# EAGLE design StraightThumbs (EAGLE 9.0.1)
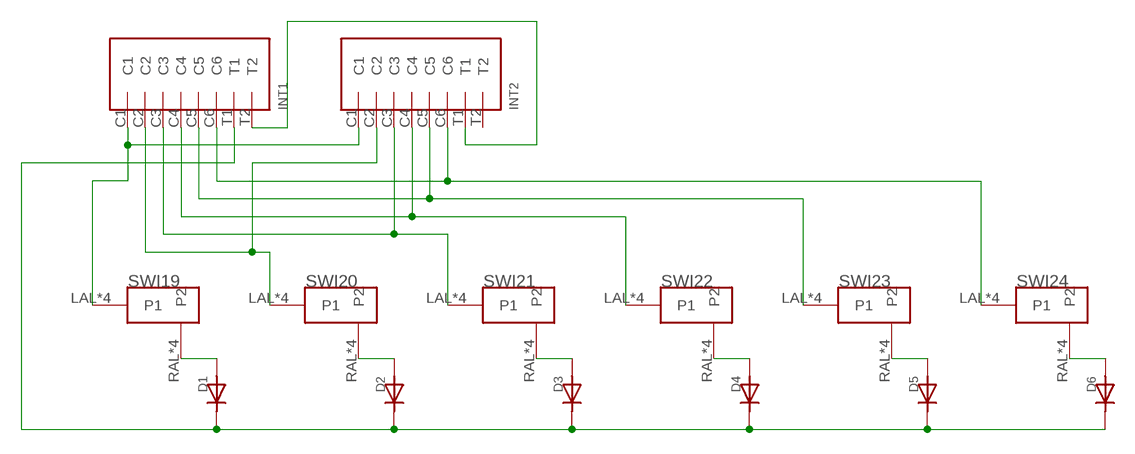
[diagram p0: schematic, sheet 1]

## Parts
D1  DIODE  [DIODE_COMBO]
D2  DIODE  [DIODE_COMBO]
D3  DIODE  [DIODE_COMBO]
D4  DIODE  [DIODE_COMBO]
D5  DIODE  [DIODE_COMBO]
D6  DIODE  [DIODE_COMBO]
INT1  INTRCNNT  [INTRCNNT]
INT2  INTRCNNT  [INTRCNNT]
SWI19  MX/ALPSDOUBLESIDED  [DOUBLED_MX/ALPS]
SWI20  MX/ALPSDOUBLESIDED  [DOUBLED_MX/ALPS]
SWI21  MX/ALPSDOUBLESIDED  [DOUBLED_MX/ALPS]
SWI22  MX/ALPSDOUBLESIDED  [DOUBLED_MX/ALPS]
SWI23  MX/ALPSDOUBLESIDED  [DOUBLED_MX/ALPS]
SWI24  MX/ALPSDOUBLESIDED  [DOUBLED_MX/ALPS]

## Nets
N$1: D1.ANOSB(AN) D1.ANOST(AN) D1.ANOT(AN) SWI19.RAL(P2) SWI19.RAR(P2) SWI19.RCL(P2) SWI19.RCR(P2)
N$2: D2.ANOSB(AN) D2.ANOST(AN) D2.ANOT(AN) SWI20.RAL(P2) SWI20.RAR(P2) SWI20.RCL(P2) SWI20.RCR(P2)
N$3: D3.ANOSB(AN) D3.ANOST(AN) D3.ANOT(AN) SWI21.RAL(P2) SWI21.RAR(P2) SWI21.RCL(P2) SWI21.RCR(P2)
N$4: D4.ANOSB(AN) D4.ANOST(AN) D4.ANOT(AN) SWI22.RAL(P2) SWI22.RAR(P2) SWI22.RCL(P2) SWI22.RCR(P2)
N$5: D5.ANOSB(AN) D5.ANOST(AN) D5.ANOT(AN) SWI23.RAL(P2) SWI23.RAR(P2) SWI23.RCL(P2) SWI23.RCR(P2)
N$6: D6.ANOSB(AN) D6.ANOST(AN) D6.ANOT(AN) SWI24.RAL(P2) SWI24.RAR(P2) SWI24.RCL(P2) SWI24.RCR(P2)
N$7: INT1.C1 INT2.C1 SWI19.LAL(P1) SWI19.LAR(P1) SWI19.LCL(P1) SWI19.LCR(P1)
N$8: INT1.C2 INT2.C2 SWI20.LAL(P1) SWI20.LAR(P1) SWI20.LCL(P1) SWI20.LCR(P1)
N$9: INT1.C3 INT2.C3 SWI21.LAL(P1) SWI21.LAR(P1) SWI21.LCL(P1) SWI21.LCR(P1)
N$10: INT1.C4 INT2.C4 SWI22.LAL(P1) SWI22.LAR(P1) SWI22.LCL(P1) SWI22.LCR(P1)
N$11: INT1.C5 INT2.C5 SWI23.LAL(P1) SWI23.LAR(P1) SWI23.LCL(P1) SWI23.LCR(P1)
N$12: INT1.C6 INT2.C6 SWI24.LAL(P1) SWI24.LAR(P1) SWI24.LCL(P1) SWI24.LCR(P1)
N$13: D1.CATSB(CAT) D1.CATST(CAT) D1.CATT(CAT) D2.CATSB(CAT) D2.CATST(CAT) D2.CATT(CAT) D3.CATSB(CAT) D3.CATST(CAT) D3.CATT(CAT) D4.CATSB(CAT) D4.CATST(CAT) D4.CATT(CAT) D5.CATSB(CAT) D5.CATST(CAT) D5.CATT(CAT) D6.CATSB(CAT) D6.CATST(CAT) D6.CATT(CAT) INT1.T1
N$14: INT1.T2 INT2.T1
Unconnected: INT2.T2

## Library data of the parts
D1-D6 = Keys:DIODE
INT1 INT2 = Keys:INTRCNNT
SWI19-SWI24 = Keys:MX/ALPS

## Board
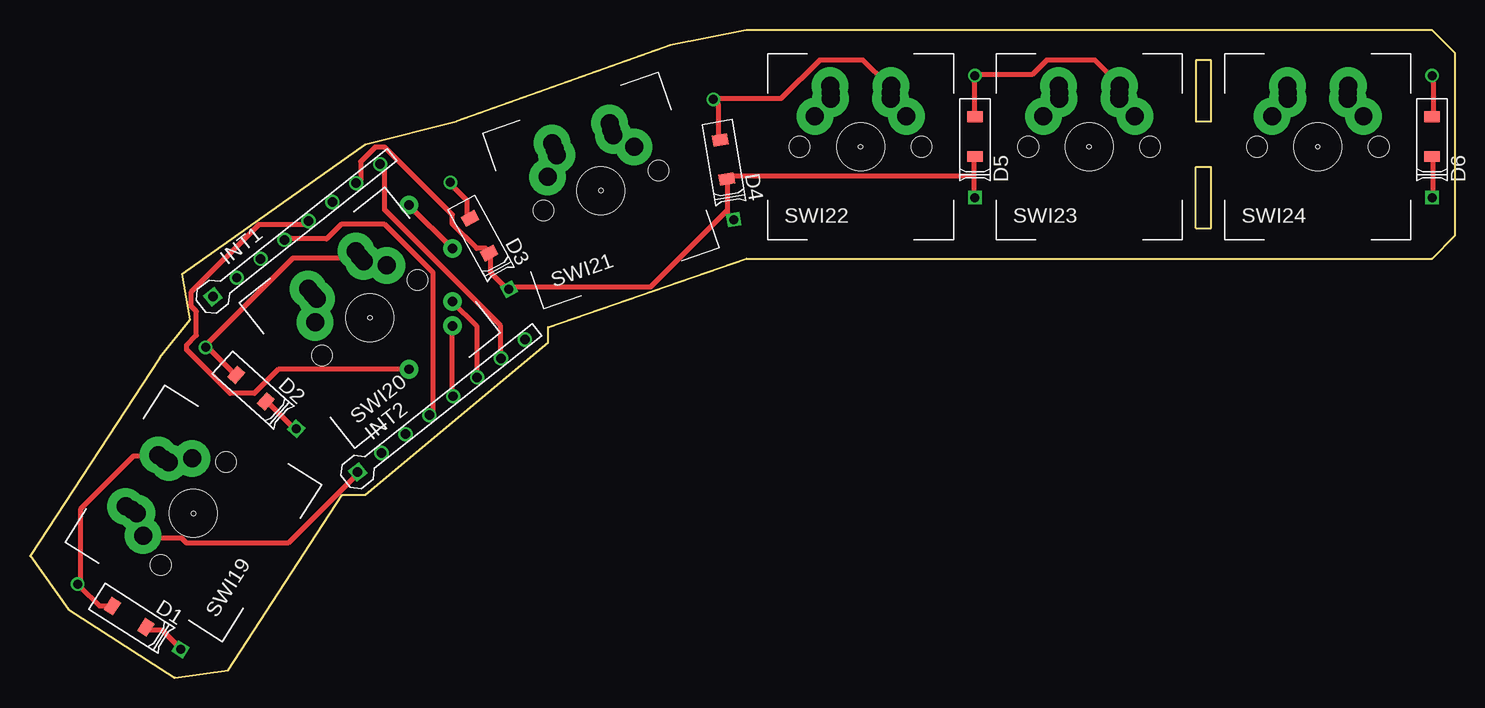
[diagram p1: board, top side]
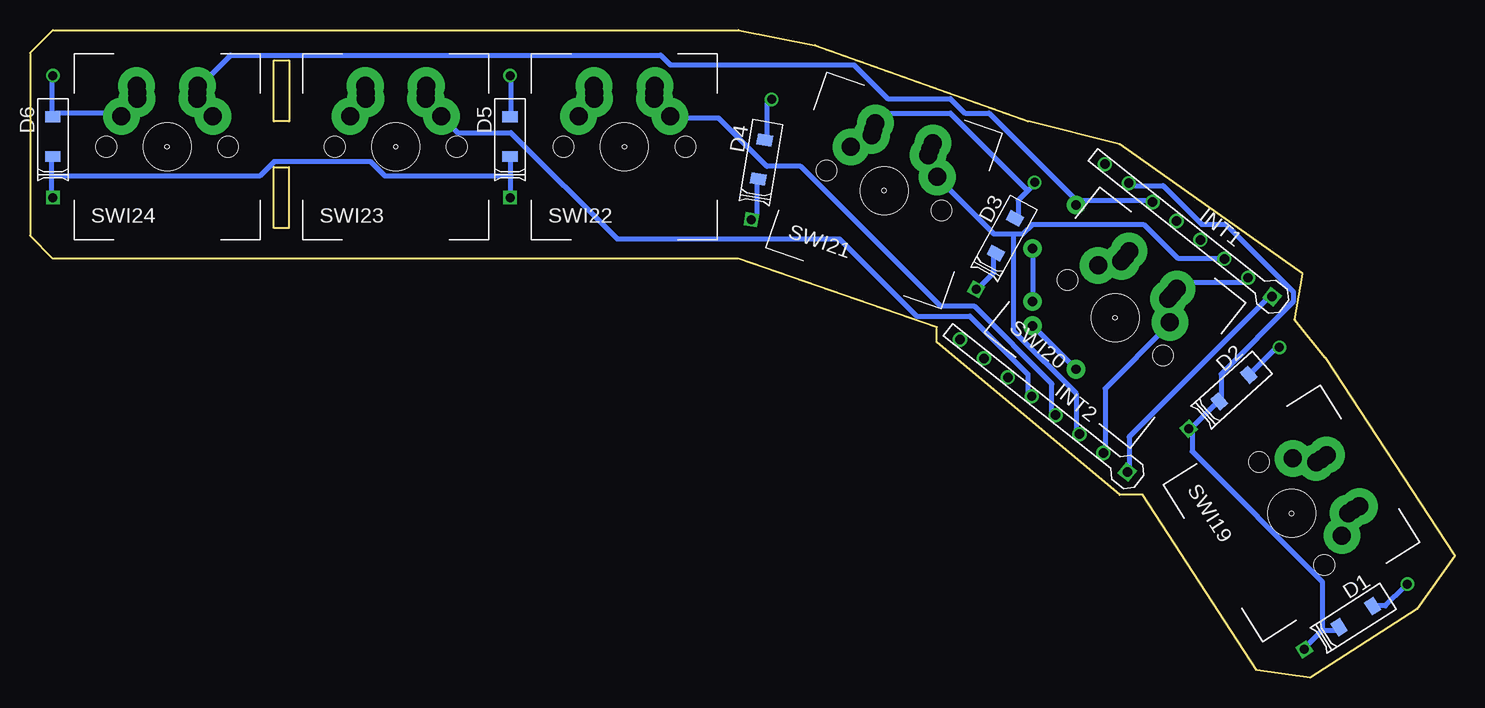
[diagram p2: board, bottom side, seen from below]

Size 118.74 x 53.97 mm. Coordinates in mm from the lower left corner, seen from the top.
Outline: 116.84,53.97 59.69,53.97 53.34,52.7 35.56,46.35 27.94,44.45 12.7,33.65 13.34,29.84 10.79,26.67 0,10.16 3.17,5.71 12.06,0 16.51,0.64 26.04,15.24 27.94,15.24 43.18,27.94 43.18,29.21 59.69,34.92 116.84,34.92 118.74,36.83 118.74,52.07 116.84,53.97
Outline: 97.16,51.43 97.16,46.35 98.42,46.35 98.42,51.43 97.16,51.43
Outline: 97.16,37.46 98.42,37.46 98.42,42.54 97.16,42.54 97.16,37.46
Copper layers (1*16): Top 0.035mm / dielectric 1.5mm / Bottom 0.035mm
Design rules "OthermillDRC_1_64_v2": minimum track width 16mil, minimum drill 31mil, track to track 0.39878125mm, track to pad 0.39878125mm, pad to pad 0.39878125mm, via to via 0.39878125mm, smd to smd 0mil, copper to edge 0mil, drill to drill 1mil, minimum pad ring 0mil, minimum via ring 15mil, stop-mask expansion 1mil, vias tented up to drill 30mil, thermal gap 10mil

### Footprints (pad centres in the part's own frame; a part is rotated, then mirrored left to right if it is on the bottom)
DIODE_COMBO = smd 0.914 x 1.27 bottom: ANOSB 1.651,0; CATSB -1.651,0 | smd 0.914 x 1.27: ANOST 1.651,0; CATST -1.651,0 | drill 0.75: ANOT 5.08,0 | drill 0.75 square: CATT -5.08,0
INTRCNNT = drill 0.787 pad 1.143 square: C1 0,0 | drill 0.787 pad 1.143: C2 2.54,0; C3 5.08,0; C4 7.62,0; C5 10.16,0; C6 12.7,0; T1 15.24,0; T2 17.78,0
DOUBLED_MX/ALPS = drill 1.5 pad 3.048: LAL -2.5,4; RAL 2.5,4 | drill 1.5: LAR -2.5,4.5; RAR 2.5,4.5 | drill 1.499 pad 3.048: LCL -3.81,2.54; LCR -2.54,5.08; RCL 3.81,2.54; RCR 2.54,5.08 | hole 0.35: 0,0 | hole 3.988: 0,0 | hole 1.702: -5.08,0; 5.08,0

### Placement (x,y rotation side)
D1  8.26,5.08 147.6 top
D2  18.41,24.13 138 top
D3  37.47,36.83 118.7 top
D4  57.79,43.18 99.6 top
D5  78.74,45.08 90 top
D6  116.84,45.08 90 top
INT1  15.24,31.75 38.4 top
INT2  27.3,17.14 38.4 top
SWI19  13.61,13.69 57.6 top
SWI20  28.32,30 38.4 top
SWI21  47.57,40.59 19.2 top
SWI22  69.21,44.25 0 top
SWI23  88.27,44.25 0 top
SWI24  107.31,44.25 0 top

### Tracks (layer width: path | path; a pad name or v marks a point on that pad's centre or on a via)
N$1
  Top 0.406: D1.ANOST 6.61,5.98 5.81,5.98 4.2,7.59 D1.ANOT 4.2,7.99 4.2,14.03 8.62,18.46 10.64,18.46 SWI19.RCR
  Bottom 0.406: D1.ANOST 6.61,5.98 5.81,5.98 4.2,7.59 D1.ANOT
N$2
  Top 0.406: 14.66,27.72 17.08,25.3 D2.ANOST | 14.66,27.72 21.91,34.96 27.14,34.96 SWI20.RCR | 14.66,27.72 D2.ANOT
  Bottom 0.406: D2.ANOST 17.08,25.3 14.66,27.72 D2.ANOT
N$3
  Top 0.406: D3.ANOST 36.4,38.59 36.4,39.79 35.2,41 D3.ANOT
  Bottom 0.406: 35.6,40.6 35.2,41 D3.ANOT | 35.6,40.6 36.4,39.79 36.4,38.59 D3.ANOST | 35.6,40.6 42.04,47.04 47.27,47.04 48.08,46.24 SWI21.RCR
N$4
  Top 0.406: D4.ANOST 57.34,45.03 57.34,47.85 D4.ANOT 57.34,48.25 62.57,48.25 65.79,51.47 69.42,51.47 71.43,49.46 SWI22.RCR
  Bottom 0.406: D4.ANOST 57.34,45.03 57.34,47.85 D4.ANOT
N$5
  Top 0.406: D5.ANOST 78.67,47.04 78.67,49.86 D5.ANOT 79.08,50.26 83.51,50.26 84.71,51.47 88.74,51.47 90.75,49.46 SWI23.RAL
  Bottom 0.406: D5.ANOST 78.67,47.04 78.67,49.86 D5.ANOT
N$6
  Top 0.406: D6.ANOST 116.92,47.04 116.92,49.86 D6.ANOT
  Bottom 0.406: D6.ANOT 116.92,49.86 116.92,47.04 D6.ANOST 116.52,47.04 111.28,47.04 SWI24.RCL
N$7
  Top 0.406: 8.62,14.03 SWI19.LCR | 8.62,14.03 SWI19.LAR 9.03,13.63 9.03,12.02 SWI19.LCL 9.43,11.61 12.65,11.61 13.05,11.21 21.51,11.21 27.14,16.85 INT2.C1 | 8.62,14.03 SWI19.LAL
  Bottom 0.406: INT2.C1 27.14,17.25 27.14,20.07 15.47,31.74 INT1.C1
N$8
  Top 0.406: SWI20.LAR 23.52,32.14 SWI20.LAL | SWI20.LCR 23.92,31.34 23.92,29.73 SWI20.LCL
  Bottom 0.406: 23.12,32.55 22.71,32.95 17.48,32.95 INT1.C2 | 23.12,32.55 SWI20.LAL | 23.12,32.55 SWI20.LCR | 23.12,32.55 SWI20.LAR | INT2.C2 29.16,18.86 29.16,24.09 23.92,29.33 SWI20.LCL
N$9
  Top 0.406: 43.65,44.22 SWI21.LAL | 43.65,44.22 SWI21.LCR 43.65,43.42 43.65,42.21 43.25,41.81 SWI21.LCL | 43.65,44.22 SWI21.LAR
  Bottom 0.406: 36.81,36.98 38.42,36.98 42.84,41.4 SWI21.LCL | 36.81,36.98 36,36.98 35.2,37.78 25.94,37.78 23.12,34.96 19.49,34.96 INT1.C3 | 36.81,36.98 36.81,28.92 31.57,23.69 31.57,20.47 INT2.C3
N$10
  Top 0.406: SWI22.LAR 67,49.05 SWI22.LCR | SWI22.LCL 65.79,47.04 66.6,47.85 SWI22.LAR | SWI22.LAL 66.6,48.25 SWI22.LAR | INT1.C4 21.51,36.57 24.73,36.57 25.94,37.78 29.56,37.78 33.59,33.75 33.59,22.08 INT2.C4
  Bottom 0.406: SWI22.LCL 65.39,46.64 61.36,46.64 57.34,42.61 54.52,42.61 42.84,30.94 40.03,30.94 33.59,24.5 33.59,22.08 INT2.C4
N$11  (via drill 0.79)
  Top 0.406: SWI23.LCR 85.92,49.05 SWI23.LAR 85.92,48.65 85.92,48.25 SWI23.LAL 85.52,47.85 84.71,47.04 SWI23.LCL | v31.57,25.7 20.7,25.7 18.69,23.69 16.68,23.69 13.05,27.31 13.05,27.72 13.86,28.52 13.86,30.54 13.46,30.94 13.46,32.14 19.09,37.78 23.12,37.78 INT1.C5 | v35.2,29.33 35.2,23.69 INT2.C5
  Bottom 0.406: INT2.C5 35.6,23.69 35.6,25.3 40.43,30.13 44.86,30.13 51.3,36.57 69.82,36.57 78.67,45.43 83.1,45.43 84.31,46.64 SWI23.LCL | v35.2,29.33 v31.57,25.7
N$12  (via drill 0.79)
  Top 0.406: SWI24.LCL 103.64,47.04 104.44,47.85 SWI24.LAL 104.84,48.25 104.84,48.65 SWI24.LAR 104.84,49.05 SWI24.LCR | v35.2,31.34 37.21,29.33 37.21,25.3 INT2.C6 | v31.57,39.39 v35.2,35.77
  Bottom 0.406: 31.57,39.79 25.53,39.79 INT1.C6 | 31.57,39.79 38.82,47.04 40.83,47.04 42.04,48.25 47.27,48.25 50.09,51.07 65.39,51.07 66.19,51.87 102.03,51.87 104.44,49.46 SWI24.LCR | v35.2,35.77 v35.2,31.34 | 31.57,39.79 v31.57,39.39
N$13
  Top 0.406: D1.CATST 9.83,3.96 11.04,3.96 12.25,2.76 D1.CATT | D2.CATST 19.9,22.89 21.91,20.87 D2.CATT | INT1.T1 27.55,41.4 27.55,43.01 28.75,44.22 29.56,44.22 35.2,38.59 35.2,37.78 37.21,35.77 38.01,35.77 D3.CATST 38.42,35.37 38.42,33.75 39.62,32.55 D3.CATT 40.03,32.55 51.7,32.55 58.14,38.99 | D6.CATST 116.92,43.42 116.92,40.2 D6.CATT | 58.14,38.99 58.14,38.59 58.55,38.18 D4.CATT | 58.14,38.99 58.14,41.4 D4.CATST 58.14,41.81 78.67,41.81 | 78.67,41.81 78.67,40.2 D5.CATT | 78.67,41.81 78.67,43.42 D5.CATST
  Bottom 0.406: 11.04,3.96 9.83,3.96 D1.CATST | 11.04,3.96 12.25,2.76 D1.CATT | 11.04,3.96 11.04,7.99 21.91,18.86 21.91,20.47 D2.CATT 21.91,20.87 19.9,22.89 D2.CATST 19.49,23.29 19.49,25.3 13.46,31.34 13.46,32.14 19.09,37.78 21.1,37.78 24.33,41 27.14,41 INT1.T1 | D3.CATST 38.42,35.37 38.42,33.75 39.62,32.55 D3.CATT | 116.92,41.81 116.92,40.2 D6.CATT | 116.92,41.81 116.92,43.42 D6.CATST | D4.CATST 58.14,41.4 58.14,38.59 58.55,38.18 D4.CATT | 78.67,41.81 78.67,40.2 D5.CATT | 78.67,41.81 78.67,43.42 D5.CATST | 116.92,41.81 99.61,41.81 98.4,43.01 90.35,43.01 89.14,41.81 78.67,41.81
N$14
  Top 0.406: INT1.T2 29.56,42.61 29.56,38.99 39.22,29.33 39.22,26.91 INT2.T1